# EAGLE design Projeck telur (EAGLE 7.6.0)
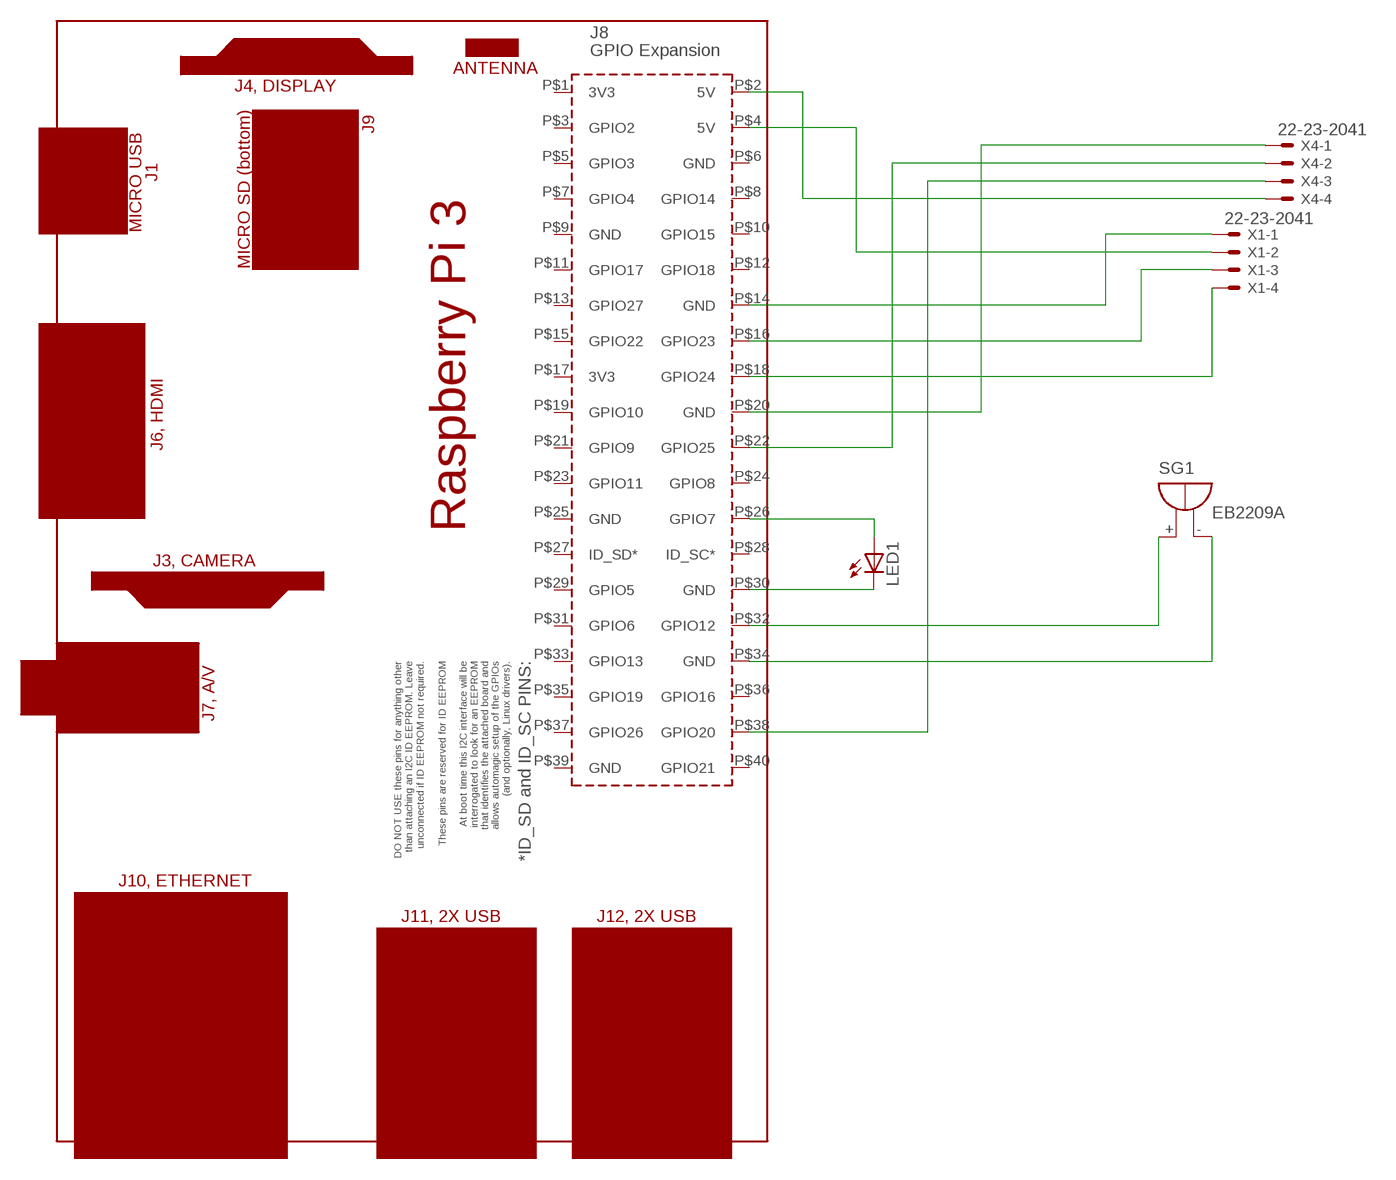
[diagram p0: schematic, sheet 1]

## Parts
LED1  LEDB152  [Q62902-B152]
PCB1  RPI3  [RPI3]
SG1  EB2209A  [EB2209A]
X1  22-23-2041  [22-23-2041]
X4  22-23-2041  [22-23-2041]

## Nets
N$1: PCB1.P$14(GND) X1.1
N$2: PCB1.P$4(5V) X1.2
N$3: PCB1.P$38(GPIO20) X4.3
N$4: PCB1.P$2(5V) X4.4
N$5: PCB1.P$22(GPIO25) X4.2
N$6: PCB1.P$20(GND) X4.1
N$7: PCB1.P$32(GPIO12) SG1.+
N$8: LED1.A PCB1.P$26(GPIO7)
N$11: LED1.K(C) PCB1.P$30(GND)
N$12: PCB1.P$16(GPIO23) X1.3
N$13: PCB1.P$18(GPIO24) X1.4
N$14: PCB1.P$34(GND) SG1.-
Unconnected: PCB1.P$1(3V3) PCB1.P$3(GPIO2) PCB1.P$5(GPIO3) PCB1.P$6(GND) PCB1.P$7(GPIO4) PCB1.P$8(GPIO14) PCB1.P$9(GND) PCB1.P$10(GPIO15) PCB1.P$11(GPIO17) PCB1.P$12(GPIO18) PCB1.P$13(GPIO27) PCB1.P$15(GPIO22) PCB1.P$17(3V3) PCB1.P$19(GPIO10) PCB1.P$21(GPIO9) PCB1.P$23(GPIO11) PCB1.P$24(GPIO8) PCB1.P$25(GND) PCB1.P$27(ID_SD*) PCB1.P$28(ID_SC*) PCB1.P$29(GPIO5) PCB1.P$31(GPIO6) PCB1.P$33(GPIO13) PCB1.P$35(GPIO19) PCB1.P$36(GPIO16) PCB1.P$37(GPIO26) PCB1.P$39(GND) PCB1.P$40(GPIO21)

## Library data of the parts
LED1 = led:LED: LED OSRAM: - CHIPLED LG R971, LG N971, LY N971, LG Q971, LY Q971, LO R971, LY R971 LH N974, LH R974 LS Q976, LO Q976, LY Q976 LO Q996 - Hyper CHIPLED LW Q18S LB Q993, LB Q99A, LB R99A - SideLED LS A670, LO A670, LY A670, LG A670, LP A670 LB A673, LV A673, LT A673, LW A673 LH A674 LY A675 LS A676, LA A676, LO A676, LY A676, LW A676 LS A679, LY A679, LG A679 - Hyper Micro SIDELED® LS Y876, LA Y876, LO Y876, LY Y876 LT Y87S - SmartLED LW L88C, LW L88S LB L89C, LB L89S, LG L890 LS L89K, LO L89K, LY L89K LS L896, LA L896, LO L896, LY L896 - TOPLED LS T670, LO T670, LY T670, LG T670, LP T670 LSG T670, LSP T670, LSY T670, LOP T670, LYG T670 LG T671, LOG T671, LSG T671 LB T673, LV T673, LT T673, LW T673 LH T674 LS T676, LA T676, LO T676, LY T676, LB T676, LH T676, LSB T676, LW T676 LB T67C, LV T67C, LT T67C, LS T67K, LO T67K, LY T67K, LW E67C LS E67B, LA E67B, LO E67B, LY E67B, LB E67C, LV E67C, LT E67C LW T67C LS T679, LY T679, LG T679 LS T770, LO T770, LY T770, LG T770, LP T770 LB T773, LV T773, LT T773, LW T773 LH T774 LS E675, LA E675, LY E675, LS T675 LS T776, LA T776, LO T776, LY T776, LB T776 LHGB T686 LT T68C, LB T68C - Hyper Mini TOPLED® LB M676 - Mini TOPLED Santana® LG M470 LS M47K, LO M47K, LY M47K Source: http://www.osram.convergy.de LUXEON: - LUMILED® LXK2-PW12-R00, LXK2-PW12-S00, LXK2-PW14-U00, LXK2-PW14-V00 LXK2-PM12-R00, LXK2-PM12-S00, LXK2-PM14-U00 LXK2-PE12-Q00, LXK2-PE12-R00, LXK2-PE12-S00, LXK2-PE14-T00, LXK2-PE14-U00 LXK2-PB12-K00, LXK2-PB12-L00, LXK2-PB12-M00, LXK2-PB14-N00, LXK2-PB14-P00, LXK2-PB14-Q00 LXK2-PR12-L00, LXK2-PR12-M00, LXK2-PR14-Q00, LXK2-PR14-R00 LXK2-PD12-Q00, LXK2-PD12-R00, LXK2-PD12-S00 LXK2-PH12-R00, LXK2-PH12-S00 LXK2-PL12-P00, LXK2-PL12-Q00, LXK2-PL12-R00 Source: www.luxeon.com KINGBRIGHT: KA-3528ASYC Source: www.kingbright.com
PCB1 = e14_Rpi3_RevA:RPI3: Device for Raspberry Pi 3 board created by Dave Young for www.element14.com More information and support community is available at https://www.element14.com/community/community/raspberry-pi
SG1 = buzzer:EB2209A: BUZZER Source: Buerklin; OC_FARNELL: unknown; OC_NEWARK: unknown
X1 X4 = con-molex:22-23-2041: .100" (2.54mm) Center Header - 4 Pin; MF: MOLEX; MPN: 22-23-2041; OC_FARNELL: 1462920; OC_NEWARK: 38C0355

## Board
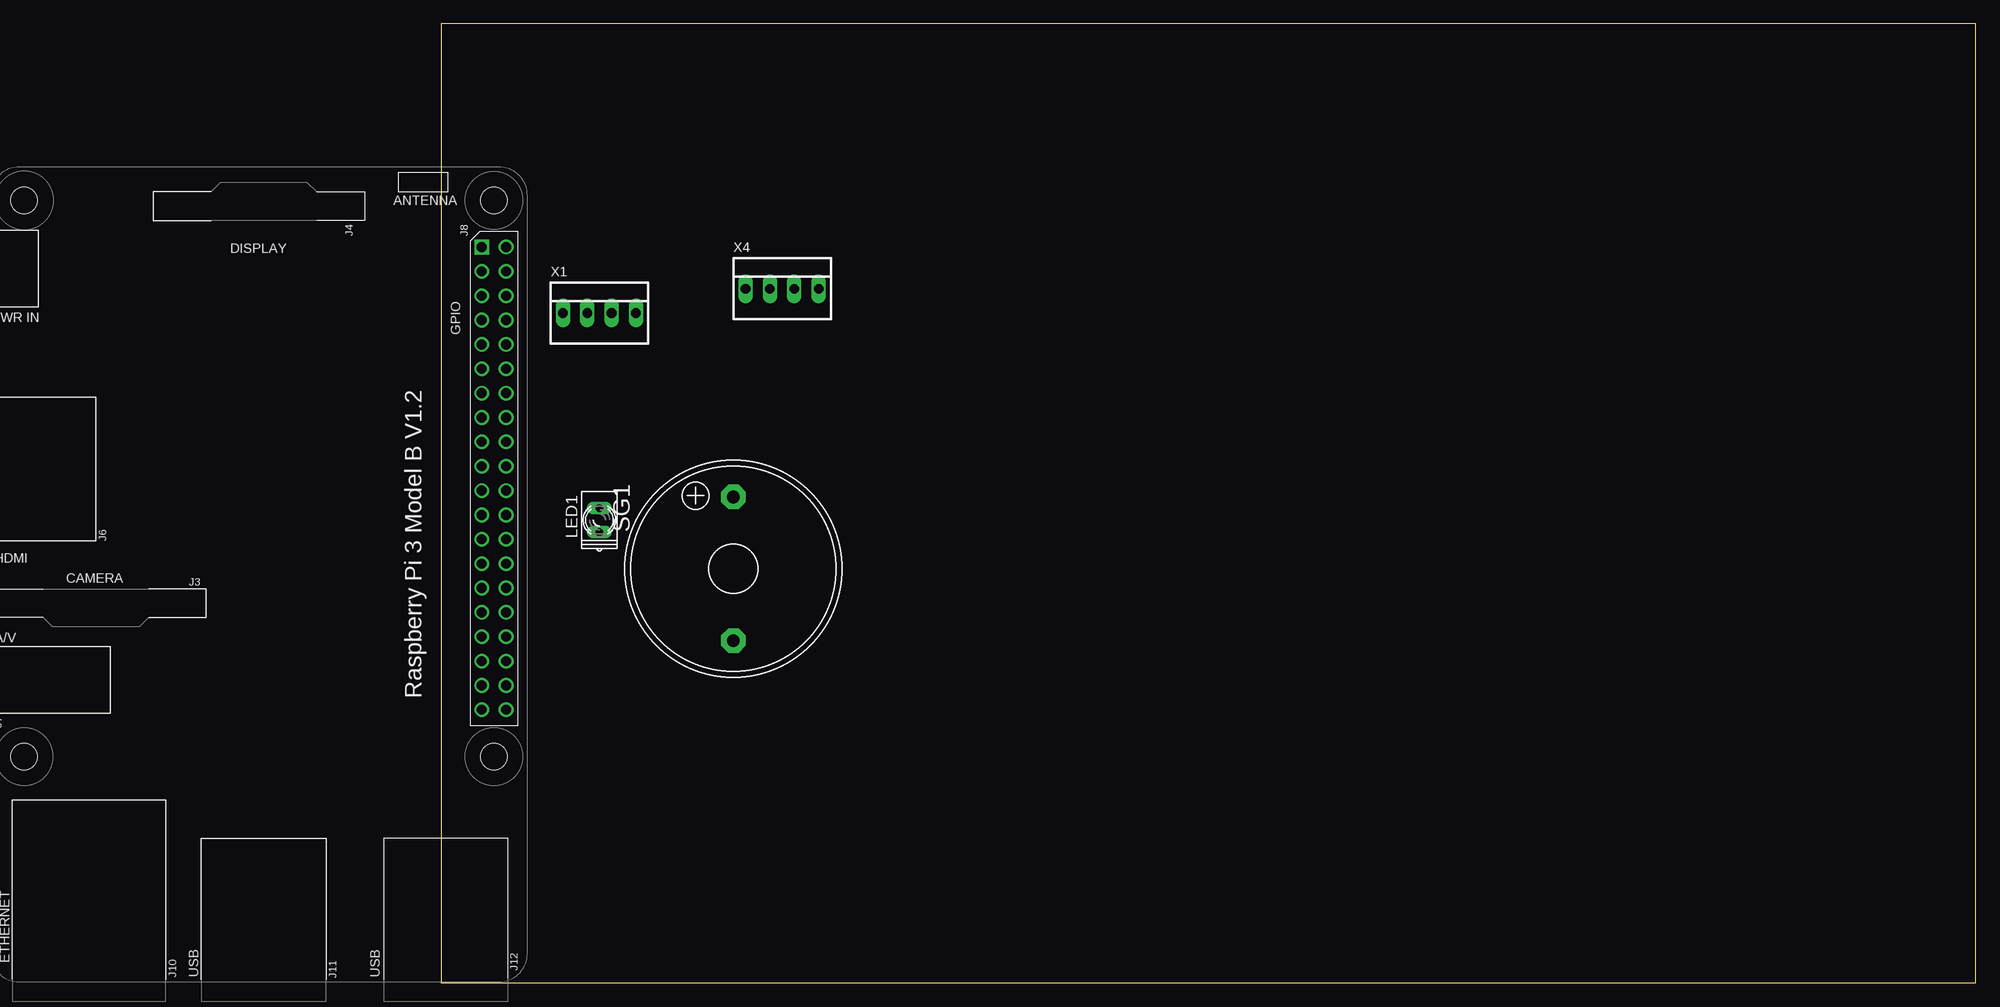
[diagram p1: board, top side]
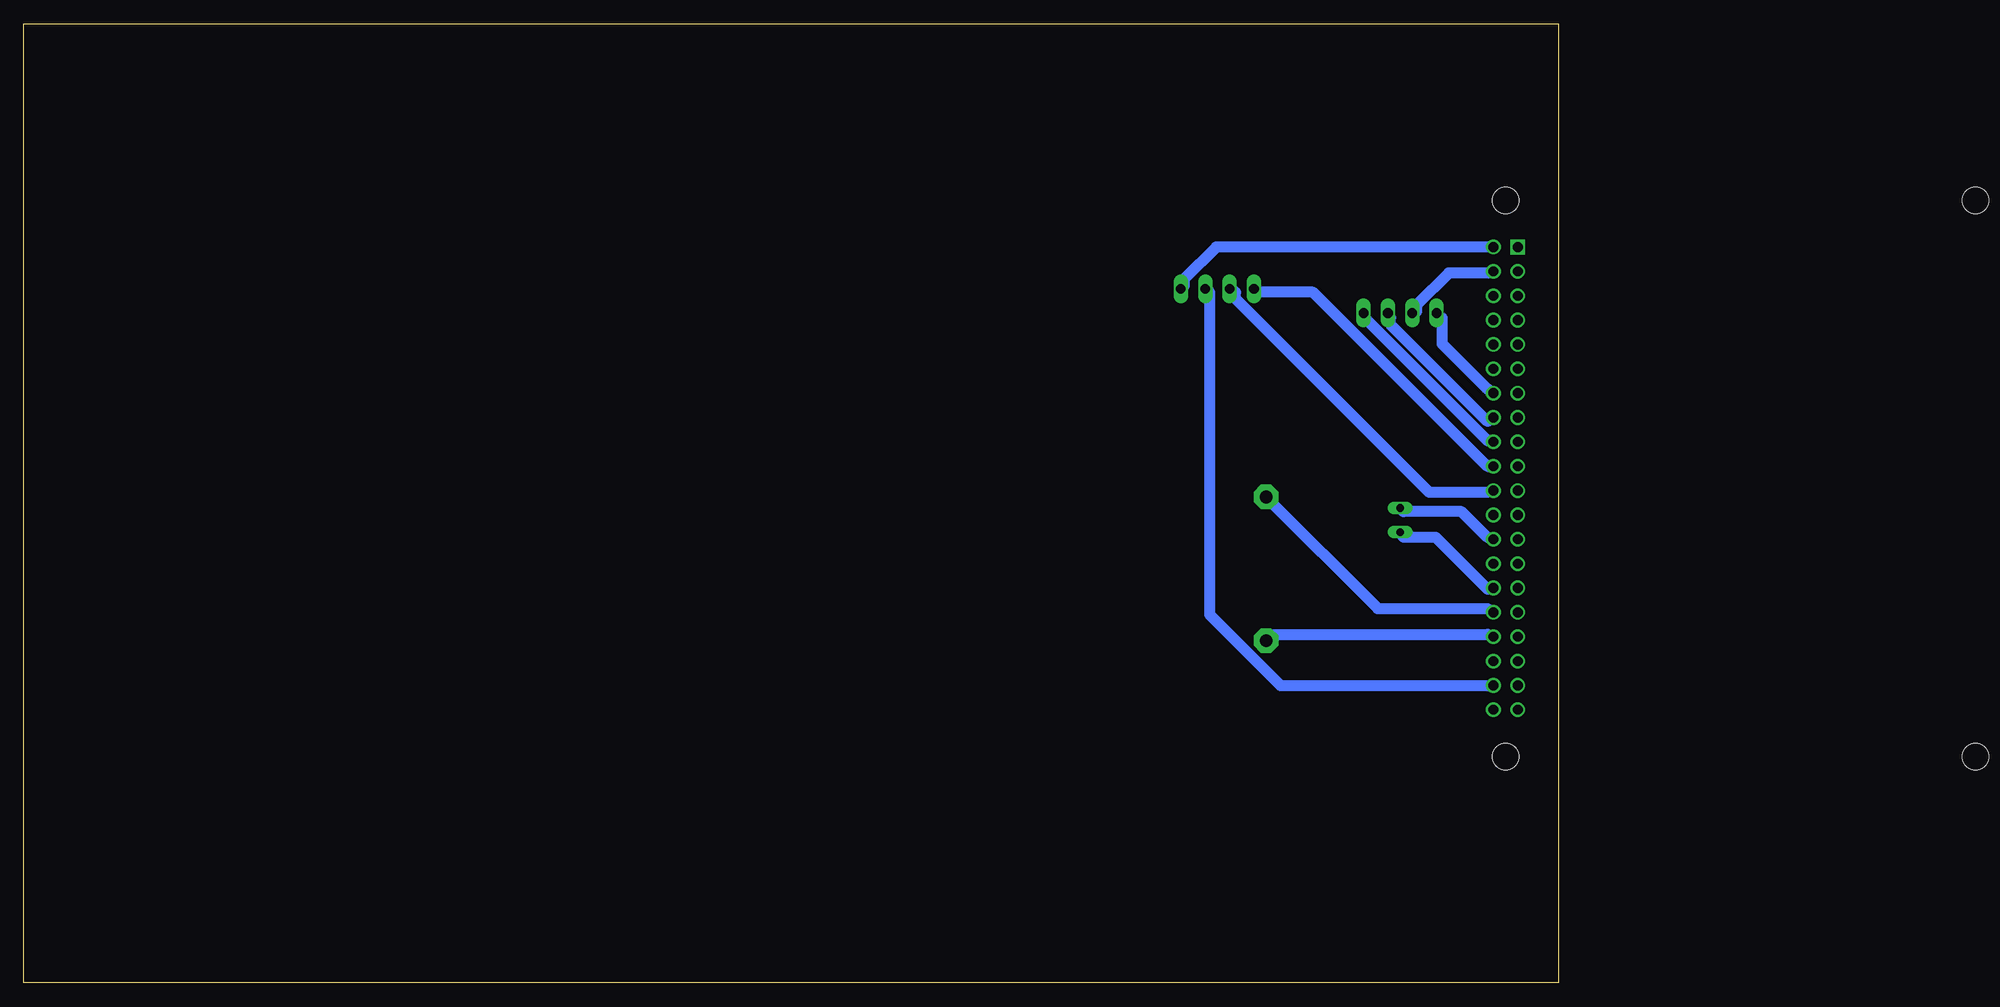
[diagram p2: board, bottom side, seen from below]

Size 160 x 100 mm. Coordinates in mm from the lower left corner, seen from the top.
Outline: 0,0 160,0 160,100 0,100 0,0
Copper layers (1*16): Top 0.035mm / dielectric 1.5mm / Bottom 0.035mm
Design rules "default *": minimum track width 45mil, minimum drill 24mil, track to track 8mil, track to pad 8mil, pad to pad 8mil, via to via 8mil, smd to smd 8mil, copper to edge 40mil, drill to drill 8mil, minimum pad ring 10mil, minimum via ring 8mil, stop-mask expansion 4mil, vias tented up to drill 0mil, thermal gap 10mil

### Footprints (pad centres in the part's own frame; a part is rotated, then mirrored left to right if it is on the bottom)
Q62902-B152 = drill 0.813 long: A 1.27,0; K -1.27,0
RPI3 = drill 1.016 square: P$1 8.37,51.23 | drill 1.016: P$2 8.357,53.772; P$3 10.897,51.232; P$4 10.897,53.772; P$5 13.437,51.232; P$6 13.437,53.772; P$7 15.977,51.232; P$8 15.977,53.772; P$9 18.517,51.232; P$10 18.517,53.772; P$11 21.057,51.232; P$12 21.057,53.772; P$13 23.597,51.232; P$14 23.597,53.772; P$15 26.137,51.232; P$16 26.137,53.772; P$17 28.677,51.232; P$18 28.677,53.772; P$19 31.217,51.232; P$20 31.217,53.772; P$21 33.757,51.232; P$22 33.757,53.772; P$23 36.297,51.232; P$24 36.297,53.772; P$25 38.837,51.232; P$26 38.837,53.772; P$27 41.377,51.232; P$28 41.377,53.772; P$29 43.917,51.232; P$30 43.917,53.772; P$31 46.457,51.232; P$32 46.457,53.772; P$33 48.997,51.232; P$34 48.997,53.772; P$35 51.537,51.232; P$36 51.537,53.772; P$37 54.077,51.232; P$38 54.077,53.772; P$39 56.617,51.232; P$40 56.617,53.772 | hole 2.75: 3.5,3.5; 61.5,3.5; 3.5,52.5; 61.5,52.5
EB2209A = drill 1.321 pad 2.54 octagon: + 7.493,0; - -7.493,0
22-23-2041 = drill 1 long: 1 -3.81,0; 2 -1.27,0; 3 1.27,0; 4 3.81,0

### Placement (x,y rotation side)
LED1  16.51,48.26 90 top
PCB1  -46.99,85.09 270 top
SG1  30.48,43.18 90 top
X1  16.51,69.85 0 top
X4  35.56,72.39 0 top

### Tracks (layer width: path | path; a pad name or v marks a point on that pad's centre or on a via)
N$1
  Bottom 1.143: X1.1 12.12,69.33 12.12,66.64 7.4,61.92 PCB1.P$14
N$2
  Bottom 1.143: X1.2 14.81,70 14.81,70.67 11.44,74.04 7.4,74.04 PCB1.P$4
N$3
  Bottom 1.143: X4.3 36.35,72.02 36.35,38.37 28.94,30.96 7.4,30.96 PCB1.P$38
N$4
  Bottom 1.143: PCB1.P$2 35.67,76.73 39.04,73.37 39.04,72.69 X4.4
N$5
  Bottom 1.143: X4.2 33.66,72.02 33.66,71.35 13.46,51.16 7.4,51.16 PCB1.P$22
N$6
  Bottom 1.143: X4.1 31.64,72.02 25.58,72.02 7.4,53.85 PCB1.P$20
N$7
  Bottom 1.143: SG1.+ 18.85,39.04 7.4,39.04 PCB1.P$32
N$8
  Bottom 1.143: LED1.A 16.15,49.14 10.1,49.14 7.4,46.44 PCB1.P$26
N$11
  Bottom 1.143: LED1.K 16.15,46.44 12.79,46.44 7.4,41.06 PCB1.P$30
N$12
  Bottom 1.143: X1.3 17.5,69.33 17.5,68.66 7.4,58.56 PCB1.P$16
N$13
  Bottom 1.143: X1.4 20.19,69.33 7.4,56.54 PCB1.P$18
N$14
  Bottom 1.143: PCB1.P$34 7.4,36.35 30.29,36.35 SG1.-